# EAGLE design Temp_NeoPixel_Ring (EAGLE 6.5.0)
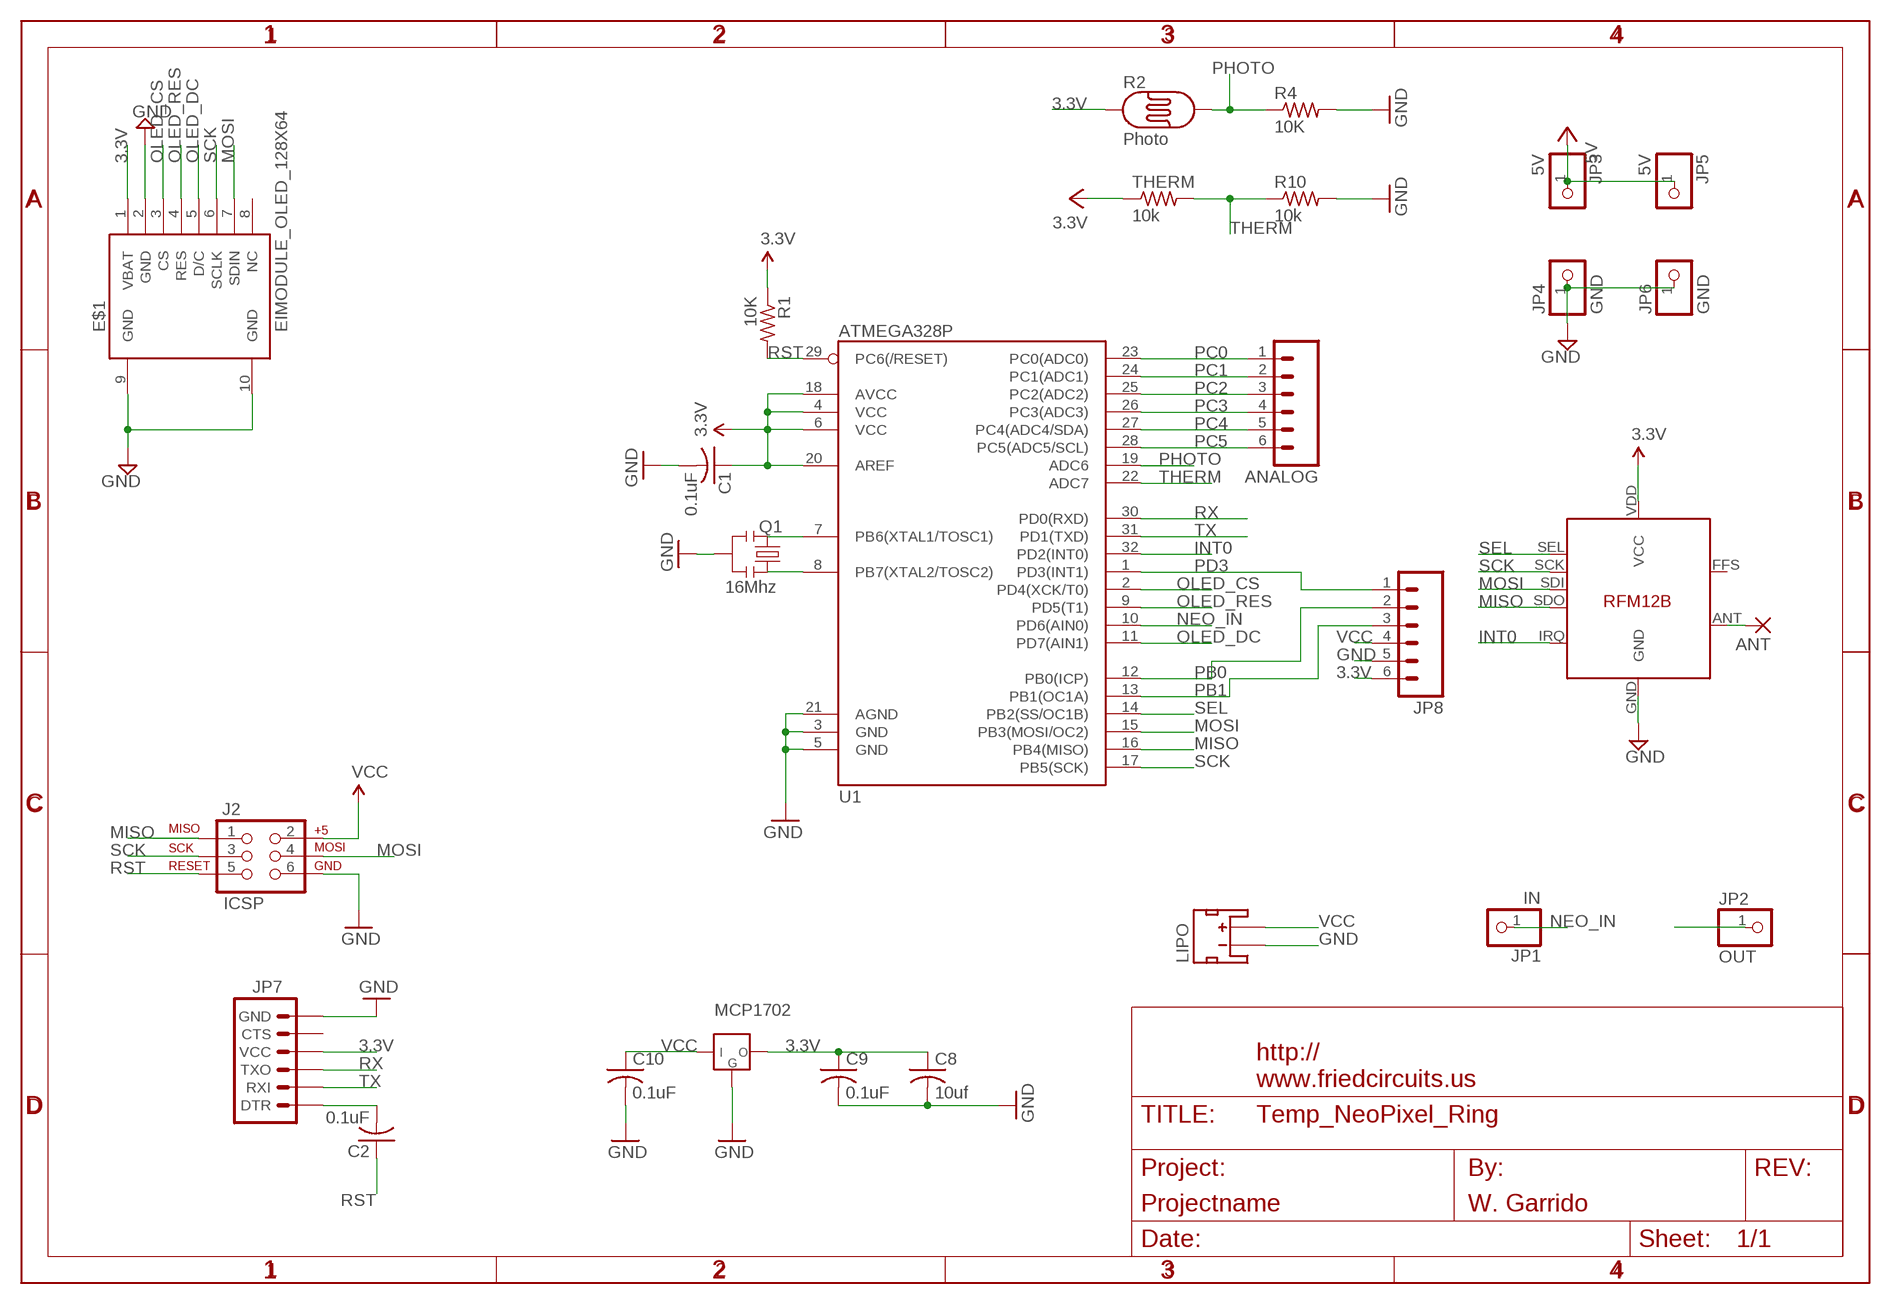
[diagram p0: schematic, sheet 1]

## Parts
ANALOG  M06LOCK  [1X06_LOCK]
ANT  1,6/0,8  [1,6/0,8]
C1  0.1uF  C-USC0805K  [C0805K]
C2  0.1uF  C-USC0805K  [C0805K]
C8  10uf  C-USC0805K  [C0805K]
C9  0.1uF  C-USC0805K  [C0805K]
C10  0.1uF  C-USC0805K  [C0805K]
E$1  EIMODULE_OLED_128X64  [EIMODULE_OLED_128X64]
J2  ICSP  AVR_SPI_PRG_62X3_LOCK  [2X3_LOCK]
JP1  IN  PINHD-1X1CB  [1X01-CLEANBIG]
JP2  OUT  PINHD-1X1CB  [1X01-CLEANBIG]
JP3  5V  PINHD-1X1CB  [1X01-CLEANBIG]
JP4  GND  PINHD-1X1CB  [1X01-CLEANBIG]
JP5  5V  PINHD-1X1CB  [1X01-CLEANBIG]
JP6  GND  PINHD-1X1CB  [1X01-CLEANBIG]
JP7  ARDUINO_SERIAL_PROGRAMLOCK  [1X06_LOCK]
JP8  M06LOCK  [1X06_LOCK]
LIPO  LIPO-3.7-6V  JST_2MM_MALE  [JST-2-SMD]
MCP1702  MCP1702SOT89  [SOT89-3]
Q1  16Mhz  RESONATORSMD  [RESONATOR-SMD]
R1  10K  R-US_R0805  [R0805]
R2  Photo  PHOTOCELLPTH  [PHOTOCELL]
R4  10K  R-US_R0805  [R0805]
R10  10k  R-US_R0805  [R0805]
THERM  10k  R-US_R0805  [R0805]
U1  ATMEGA328P  ATMEGA328_SMT  [TQFP32-08]
U$1  FRAME_DINA4_L  [FC_CREDIT]
U$2  RFM12B  [RFM12B]

## Nets
3.3V [power]: C1.1 C8.1 C9.1 E$1.1(VBAT) J2.2 JP7.4(VCC) JP8.6 MCP1702.3(E) R1.1 R2.1 THERM.1 U1.4(VCC) U1.6(VCC) U1.18(AVCC) U1.20(AREF) U$2.VDD(VCC) ; supply symbol labelled VCC
GND: C1.2 C8.2 C9.2 C10.2 E$1.2(GND) E$1.9(GND) E$1.10(GND) J2.6 JP4.1 JP6.1 JP7.6(GND) JP8.5 LIPO.1(-) MCP1702.1(B) Q1.2 R4.2 R10.2 U1.3(GND) U1.5(GND) U1.21(AGND) U$2.GND
INT0: U1.32(PD2(INT0)) U$2.IRQ
MISO: J2.1 U1.16(PB4(MISO)) U$2.SDO
MOSI: E$1.7(SDIN) J2.4 U1.15(PB3(MOSI/OC2)) U$2.SDI
N$2: C2.2 JP7.1(DTR)
N$9: Q1.1 U1.8(PB7(XTAL2/TOSC2))
N$11: Q1.3 U1.7(PB6(XTAL1/TOSC1))
N$12: ANT.1(P) U$2.ANT
NEO_IN: JP1.1 U1.10(PD6(AIN0))
OLED_CS: E$1.3(CS) U1.2(PD4(XCK/T0))
OLED_DC: E$1.5(D/C) U1.11(PD7(AIN1))
OLED_RES: E$1.4(RES) U1.9(PD5(T1))
OUT: JP2.1
PB0: JP8.2 U1.12(PB0(ICP))
PB1: JP8.3 U1.13(PB1(OC1A))
PC0: ANALOG.1 U1.23(PC0(ADC0))
PC1: ANALOG.2 U1.24(PC1(ADC1))
PC2: ANALOG.3 U1.25(PC2(ADC2))
PC3: ANALOG.4 U1.26(PC3(ADC3))
PC4: ANALOG.5 U1.27(PC4(ADC4/SDA))
PC5: ANALOG.6 U1.28(PC5(ADC5/SCL))
PD3: JP8.1 U1.1(PD3(INT1))
PHOTO: R2.2 R4.1 U1.19(ADC6)
RST: C2.1 J2.5 R1.2 U1.29(PC6(/RESET))
RX: JP7.3(TXO) U1.30(PD0(RXD))
SCK: E$1.6(SCLK) J2.3 U1.17(PB5(SCK)) U$2.SCK
SEL: U1.14(PB2(SS/OC1B)) U$2.SEL
THERM: R10.1 THERM.2 U1.22(ADC7)
TX: JP7.2(RXI) U1.31(PD1(TXD))
VCC [power]: C10.1 JP3.1 JP5.1 JP8.4 LIPO.2(+) MCP1702.2(C) ; supply symbol labelled 5V
Unconnected: E$1.8(NC) JP7.5(CTS) LIPO.NC1(PAD1) LIPO.NC2(PAD2) U$2.FFS

## Library data of the parts
ANALOG JP8 = SparkFun-Connectors:M06: Header 6 Standard 6-pin 0.1" header. Use with straight break away headers (SKU : PRT-00116), right angle break away headers (PRT-00553), swiss pins (PRT-00743), machine pins (PRT-00117), and female headers (PRT-00115). Molex polarized connector foot print use with SKU : PRT-08094 with associated crimp pins and housings. NOTES ON THE VARIANTS LOCK and LOCK_LONGPADS... This footprint was designed to help hold the alignment of a through-hole component (i.e. 6-pin header) while soldering it into place. You may notice that each hole has been shifted either up or down by 0.005 of an inch from it's more standard position (which is a perfectly straight line). This slight alteration caused the pins (the squares in the middle) to touch the edges of the holes. Because they are alternating, it causes a "brace" to hold the component in place. 0.005 has proven to be the perfect amount of "off-center" position when using our standard breakaway headers. Although looks a little odd when you look at the bare footprint, once you have a header in there, the alteration is very hard to notice. Also,if you push a header all the way into place, it is covered up entirely on the bottom side. This idea of altering the position of holes to aid alignment will be further integrated into the Sparkfun Library for other footprints. It can help hold any component with 3 or more connection pins.
ANT = JeeLabs:1,6/0,8: THROUGH-HOLE PAD
C1 C2 C8-C10 = adafruit:C-US: CAPACITOR, American symbol
E$1 = FriedCircuits:EIMODULE_OLED_128X64
J2 = SparkFun-Connectors:AVR_SPI_PRG_6: AVR ISP 6 Pin This is the reduced ISP connector for AVR programming. Common on Arduino. This footprint will take up less PCB space and can be used with a 10-pin to 6-pin adapter such as SKU: BOB-08508
JP1-JP6 = adafruit:PINHD-1X1: Pin header 1x1 for 0.1" spacing With round pins
JP7 = SparkFun-Connectors:ARDUINO_SERIAL_PROGRAM: FTDI connector footprints
LIPO = SparkFun-Connectors:JST_2MM_MALE: Mates to single-cell LiPo batteries. CONN-08352; PROD_ID: CONN-08352
MCP1702 = FriedCircuits:MCP1702: MCP1702 LDO Regulator in SOT-89, SOT-23A-2 and TO-92
Q1 = SparkFun:RESONATOR: Resonator Small SMD resonator. This is the itty bitty 10/20MHz resonators with built in caps. CSTCE10M0G55 and CSTCE20M0V53. Footprint has been reviewed closely but hasn't been tested yet.
R1 R4 R10 THERM = adafruit:R-US_: RESISTOR, American symbol
R2 = SparkFun:PHOTOCELL: Photocell Also known as a CdS photoresistor. This is a low cost way to detect light levels. Resistance decreases with more incoming light. SparkFun SKU: SEN-09088
U1 = SparkFun-DigitalIC:ATMEGA328_SMT: 32-Pin Atmega328 part Commonly used on Arduino compatible boards Available in QFP and QFN packages TQFP is IC-09069 QFN is non-stock; PROD_ID: IC-09069
U$1 = FriedCircuits:FRAME_DINA4_L: A4 FC frame Standard FriedCircuits schematic frame. Automagically adds the standard texts to the PCB Use the atrribute in the schematic editor to change the fields.; AUTHOR: W. Garrido; FF1: fulfillment by; FF2: FriedCircuits; FF3: www.friedcircuits.us; PROJECT: Projectname; URL1: http://; URL2: www.friedcircuits.us
U$2 = lh-library:RFM12B

## Net classes
0 default: width 0.203 mm, drill 0.203 mm
1 power: width 0.254 mm, drill 0.203 mm
3 3.3V: width 0.254 mm, drill 0.203 mm

## Board
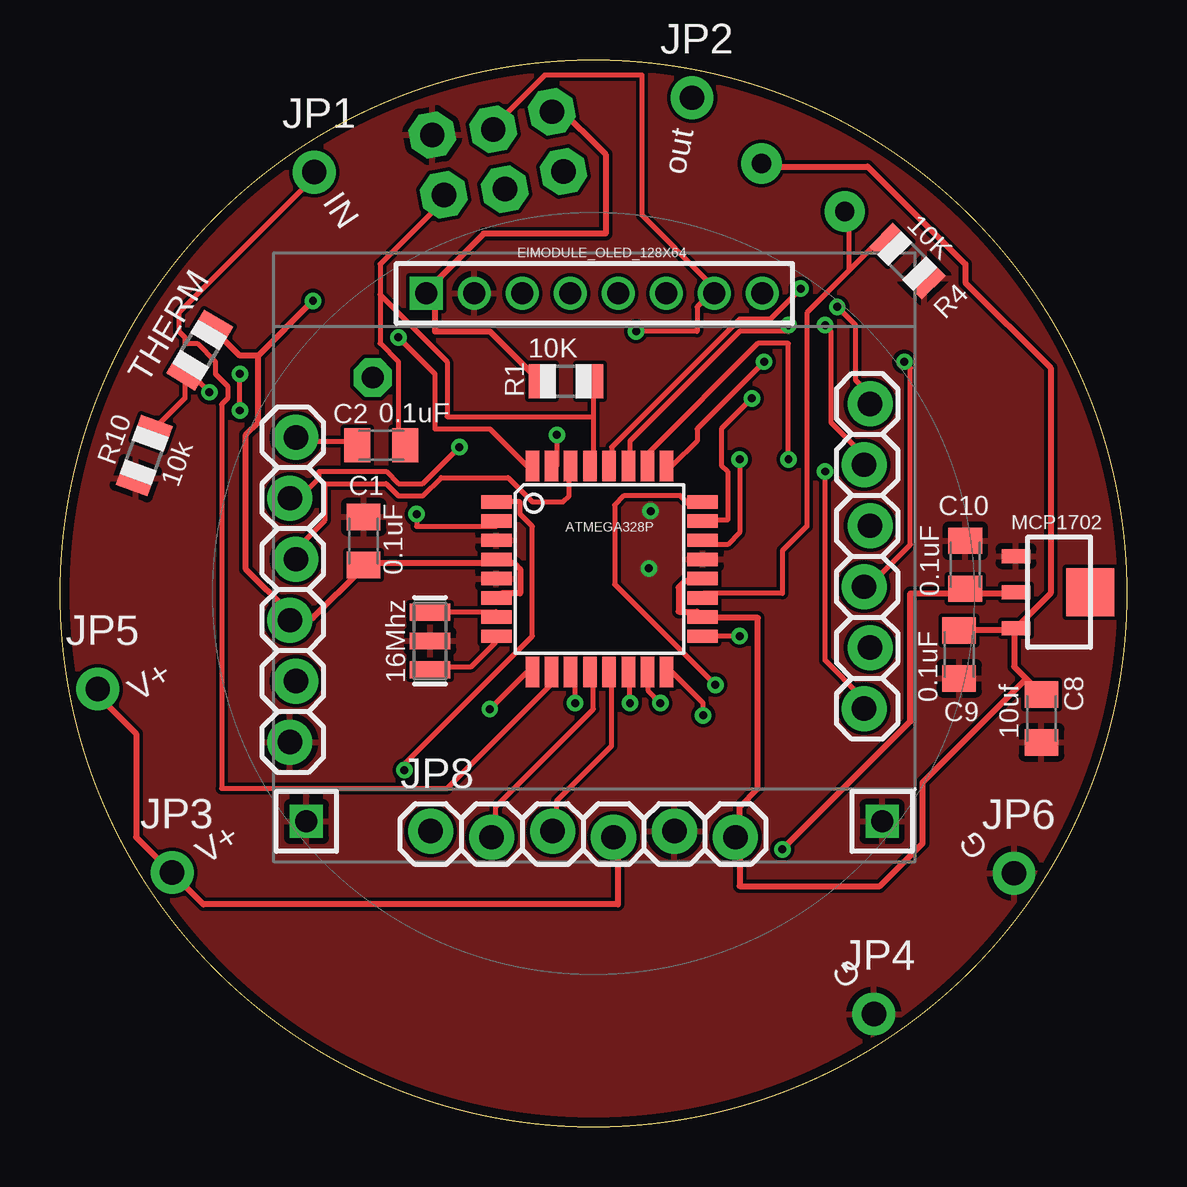
[diagram p1: board, top side]
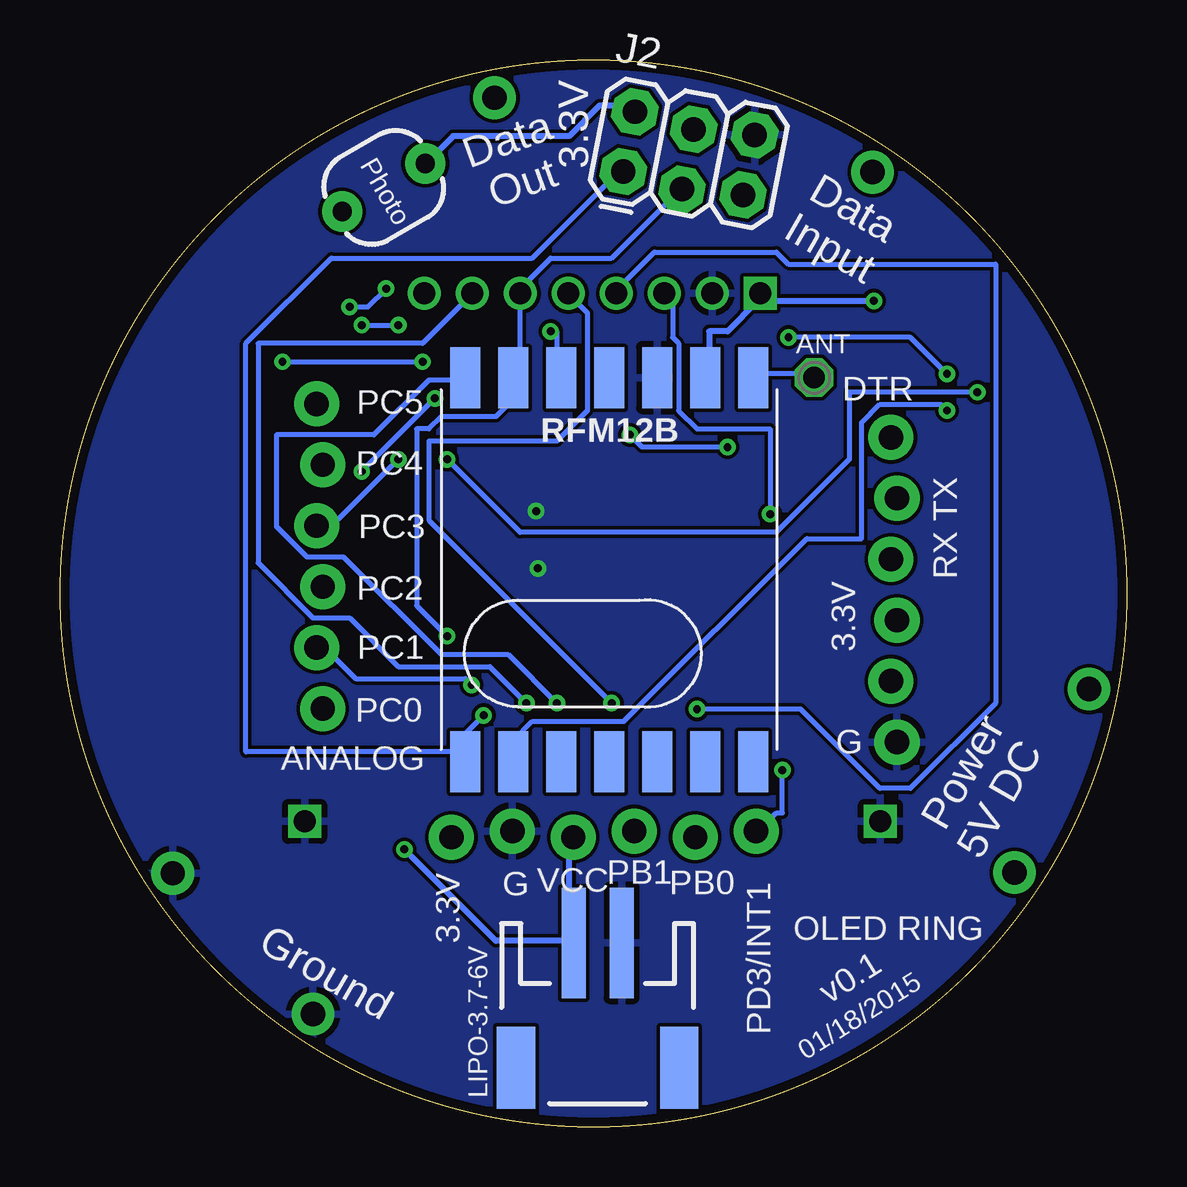
[diagram p2: board, bottom side, seen from below]

Size 44.45 x 44.45 mm. Coordinates in mm from the lower left corner, seen from the top.
Outline: circle at 22.23,22.23 radius 22.23
Copper layers (1*16): Top 0.0356mm / dielectric 1.5011mm / Bottom 0.0356mm
Design rules "LaenPCBOrder-Tinited": minimum track width 6mil, minimum drill 13mil, track to track 6mil, track to pad 6mil, pad to pad 6mil, via to via 6mil, smd to smd 6mil, copper to edge 15mil, drill to drill 6mil, minimum pad ring 7mil, minimum via ring 7mil, stop-mask expansion 2mil, vias tented up to drill 100mil, thermal gap 10mil

### Footprints (pad centres in the part's own frame; a part is rotated, then mirrored left to right if it is on the bottom)
1X06_LOCK = drill 1.016 pad 1.88: 1 0,0; 2 2.54,-0.254; 3 5.08,0; 4 7.62,-0.254; 5 10.16,0; 6 12.7,-0.254
1,6/0,8 = drill 0.9 pad 1.6 octagon: 1 0,0
C0805K = smd 1.1 x 1.4: 1 -1,0; 2 1,0
EIMODULE_OLED_128X64 = drill 0.914 square: 1 6.35,23.7; 9 1.35,1.7; 10 25.34,1.7 | drill 0.914: 2 8.35,23.7; 3 10.35,23.7; 4 12.35,23.7; 5 14.35,23.7; 6 16.35,23.7; 7 18.35,23.7; 8 20.35,23.7
2X3_LOCK = drill 1.016 pad 1.88 octagon: 1 0,0; 2 0,2.54; 3 2.54,-0.254; 4 2.54,2.286; 5 5.08,0; 6 5.08,2.54
1X01-CLEANBIG = drill 1.016 pad 1.778: 1 0,0
JST-2-SMD = smd 1 x 4.6: 1 -1,-3.7; 2 1,-3.7 | smd 1.6 x 3.4: NC1 -3.4,1.5; NC2 3.4,1.5
SOT89-3 = smd 0.58 x 1.2: 1 -1.5,-1.8; 2 0,-1.8; 3 1.5,-1.8 | smd 2 x 2: 4 0,1.3
RESONATOR-SMD = smd 0.7 x 1.7: 1 -1.2,0; 2 0,0; 3 1.2,0
R0805 = smd 1.1 x 1.4: 1 -1,0; 2 1,0
PHOTOCELL = drill 0.8 pad 1.676: 1 -2,0; 2 2,0
TQFP32-08 = smd 1.27 x 0.559: 1 -4.293,2.8; 2 -4.293,2; 3 -4.293,1.2; 4 -4.293,0.4; 5 -4.293,-0.4; 6 -4.293,-1.2; 7 -4.293,-2; 8 -4.293,-2.8; 17 4.293,-2.8; 18 4.293,-2; 19 4.293,-1.2; 20 4.293,-0.4; 21 4.293,0.4; 22 4.293,1.2; 23 4.293,2; 24 4.293,2.8 | smd 0.559 x 1.27: 9 -2.8,-4.293; 10 -2,-4.293; 11 -1.2,-4.293; 12 -0.4,-4.293; 13 0.4,-4.293; 14 1.2,-4.293; 15 2,-4.293; 16 2.8,-4.293; 25 2.8,4.293; 26 2,4.293; 27 1.2,4.293; 28 0.4,4.293; 29 -0.4,4.293; 30 -1.2,4.293; 31 -2,4.293; 32 -2.8,4.293
RFM12B = smd 2.54 x 1.27: ANT 8,-6; FFS -8,2; GND 8,-2; IRQ -8,4; P$8 -8,0; P$9 -8,-2; P$10 -8,-4; P$12 -8,-6; P$16 8,0; SCK 8,4; SDI 8,2; SDO -8,6; SEL 8,6; VDD 8,-4

### Placement (x,y rotation side)
ANALOG  33.5,17.42 90 top
ANT  13.03,31.22 0 bottom
C1  12.65,24.41 90 top
C2  13.39,28.4 180 top
C8  40.89,17.02 270 top
C9  37.47,19.69 270 top
C10  37.72,23.42 90 top
E$1  8.92,11.02 0 top
J2  20.98,39.8 349 bottom
JP1  10.59,39.78 0 top
JP2  26.34,42.88 0 top
JP3  4.67,10.59 0 top
JP4  33.91,4.7 0 top
JP5  1.57,18.24 0 top
JP6  39.75,10.57 0 top
JP7  9.83,28.73 270 top
JP8  15.44,12.32 0 top
LIPO  22.05,3.96 180 bottom
MCP1702  41.63,22.28 270 top
Q1  15.42,20.24 90 top
R1  21.08,31.06 0 top
R2  30.96,39.14 210 bottom
R4  35.31,36.07 315 top
R10  3.51,27.97 250 top
THERM  5.82,32.36 239 top
U1  22.48,23.24 0 top
U$1  -11.15,4.8 0 top  (outside the outline)
U$2  21.56,23.22 90 bottom

### Tracks (layer width: path | path; a pad name or v marks a point on that pad's centre or on a via)
3.3V  (via drill 0.33)
  Top 0.254: 39.75,20.7 37.47,20.7 C9.1 | 40.26,18.67 39.75,19.18 39.75,20.7 | 40.26,18.67 40.77,18.16 C8.1 | 39.75,20.7 MCP1702.3 40.01,20.96 41.28,22.23 41.28,31.62 37.72,35.18 37.72,35.94 33.66,40.01 29.34,40.01 R2.1 | U1.20 26.54,22.73 26.04,22.73 25.78,22.48 25.78,21.46 26.54,21.46 U1.18 26.8,21.21 29.08,21.21 29.08,14.1 28.32,13.34 28.32,12.07 | 40.26,18.67 35.94,14.35 35.94,11.81 34.16,10.03 28.32,10.03 28.32,12.07 | 28.32,12.07 JP8.6 | U1.6 18.42,22.23 19.18,22.23 19.18,23.24 18.92,23.5 18.42,23.5 U1.4 18.16,23.5 12.83,23.5 C1.1 12.57,23.24 10.54,21.21 9.78,21.21 JP7.4 9.53,21.21 9.53,21.46 7.75,23.24 7.75,28.83 8.26,29.34 8.26,32.13 | 8.26,32.13 7.49,32.13 6.48,33.15 THERM.1 | R1.1 19.94,31.12 17.91,33.15 15.62,33.15 15.62,34.42 15.37,34.67 E$1.1 15.37,34.92 17.65,37.21 22.73,37.21 22.73,40.51 20.7,42.55 J2.2 | v10.54,34.42 8.26,32.13
  Bottom 0.254: 15.37,34.42 15.11,34.67 E$1.1 15.37,34.42 | 15.37,34.42 16.64,33.15 17.4,33.15 17.4,31.37 U$2.VDD | R2.1 29.08,40.26 28.07,41.28 23.24,41.28 21.97,42.55 20.7,42.55 J2.2 | 15.37,34.42 v10.54,34.42
GND  (via drill 0.33)
  other vias: 24.54,23.27 24.61,25.65
  pour Top: 45.09,22.23 arc90 22.23,45.09 arc90 -0.63,22.23 arc90 22.23,-0.63 arc90
  pour Bottom: 45.09,22.23 arc90 22.23,45.09 arc90 -0.63,22.23 arc90 22.23,-0.63 arc90
INT0  (via drill 0.33)
  Top 0.203: v14.1,32.89 15.62,31.37 15.62,29.08 17.91,29.08 19.43,27.56 U1.32 | v7.49,29.85 v7.49,31.37
  Bottom 0.203: v14.1,32.89 9.02,32.89 v7.49,31.37 | v7.49,29.85 7.75,30.1 10.29,30.1 11.05,29.34 11.05,24.51 13.34,24.51 20.96,16.89 24.77,16.89 25.53,16.13 25.53,15.37 U$2.IRQ
MISO  (via drill 0.33)
  Top 0.203: v26.8,17.15 26.8,17.65 25.53,18.92 U1.16
  Bottom 0.203: v26.8,17.15 27.56,16.38 27.56,15.62 | 27.56,15.62 27.56,15.37 U$2.SDO 27.56,15.62 | 27.56,15.62 36.7,15.62 36.7,32.64 33.15,36.2 24.77,36.2 21.21,39.75 J2.1
MOSI  (via drill 0.33)
  Top 0.203: v25.02,17.65 24.51,18.16 24.51,18.92 U1.15 | v24,33.15 26.54,33.15 26.54,34.16 27.05,34.67 E$1.7 27.05,34.92 27.05,35.18 24.26,37.97 24.26,43.81 20.19,43.81 18.16,41.78 J2.4
  Bottom 0.203: v25.02,17.65 26.54,19.18 30.35,19.18 32.39,21.21 33.91,21.21 36.2,23.5 36.2,32.64 29.34,32.64 27.3,34.67 E$1.7 | v24,33.15 23.75,33.15 23.75,31.37 U$2.SDI
N$2
  Top 0.203: C2.2 12.32,28.58 10.03,28.58 JP7.1
N$9
  Top 0.203: U1.8 18.16,20.19 17.15,19.18 15.62,19.18 Q1.1
N$11
  Top 0.203: U1.7 18.16,21.46 15.62,21.46 Q1.3
N$12
  Bottom 0.203: U$2.ANT 15.37,31.37 13.08,31.37 ANT.1
NEO_IN
  Top 0.203: U1.10 20.45,18.92 20.45,18.42 16.13,14.1 6.73,14.1 6.73,30.1 6.99,30.35 6.99,30.86 6.48,31.37 6.48,31.88 5.71,32.64 5.21,32.64 5.21,32.89 4.95,33.15 4.95,33.91 10.54,39.5 10.54,39.75 JP1.1
OLED_CS  (via drill 0.33)
  Top 0.203: v14.86,25.53 14.86,25.02 18.16,25.02 U1.2
  Bottom 0.203: v14.86,25.53 14.86,29.08 17.91,29.08 18.67,29.85 18.67,32.64 18.92,32.89 18.92,34.67 19.18,34.67 E$1.3
OLED_DC  (via drill 0.33)
  Top 0.203: v21.46,17.65 21.46,18.92 U1.11
  Bottom 0.203: v21.46,17.65 29.08,25.27 29.08,28.58 23.75,28.58 22.48,29.85 22.48,33.91 23.24,34.67 E$1.5
OLED_RES  (via drill 0.33)
  Top 0.203: v17.91,17.4 19.43,18.92 U1.9
  Bottom 0.203: v17.91,17.4 13.59,17.4 10.29,14.1 9.02,14.1 5.46,17.65 5.46,35.94 14.1,35.94 14.61,36.45 19.69,36.45 21.21,34.92 E$1.4
PB0
  Top 0.203: U1.12 22.23,18.92 22.23,17.4 18.16,13.34 18.16,12.07 JP8.2
PB1
  Top 0.203: U1.13 22.99,18.92 22.99,15.88 20.7,13.59 20.7,12.32 JP8.3
PC0  (via drill 0.33)
  Top 0.203: v28.83,30.35 27.56,29.08 27.56,27.56 27.81,27.3 27.81,25.27 26.8,25.27 U1.23 | v31.88,27.3 31.88,19.43 33.4,17.91 33.4,17.65 ANALOG.1
  Bottom 0.203: v31.88,27.3 v28.83,30.35
PC1  (via drill 0.33)
  Top 0.203: 26.54,26.04 U1.24 26.69,25.96 26.19,25.96 25.83,26.31 23.52,26.31 23.11,25.91 23.11,22.61 v27.3,18.42
  Bottom 0.203: v27.3,18.42 27.56,18.67 32.13,18.67 33.4,19.94 33.66,19.94 ANALOG.2
PC2  (via drill 0.33)
  Top 0.203: v29.34,31.88 26.54,29.08 26.54,28.58 25.53,27.56 U1.25 | v35.18,31.88 35.43,31.62 35.43,24.26 33.66,22.48 ANALOG.3
  Bottom 0.203: v35.18,31.88 v29.34,31.88
PC3  (via drill 0.33)
  Top 0.203: v30.35,27.81 30.35,32.64 29.08,32.64 24.51,28.07 24.51,27.56 U1.26
  Bottom 0.203: v30.35,27.81 32.89,25.27 33.66,25.27 ANALOG.4
PC4  (via drill 0.33)
  Top 0.203: v30.35,33.4 30.35,33.15 28.32,33.15 23.75,28.58 23.75,27.56 U1.27 | v31.88,33.4 32.13,33.15 32.13,29.34 33.4,28.07 33.4,27.81 ANALOG.5
  Bottom 0.203: v31.88,33.4 v30.35,33.4
PC5  (via drill 0.33)
  Top 0.203: v30.86,34.92 29.59,33.66 28.32,33.66 22.99,28.32 22.99,27.56 U1.28 | v32.39,34.16 33.15,33.4 33.15,31.12 33.66,30.61 33.66,30.35 ANALOG.6
  Bottom 0.203: v30.86,34.92 31.62,34.16 v32.39,34.16
PD3  (via drill 0.33)
  Top 0.203: v14.35,14.86 14.35,15.11 19.69,20.45 19.69,25.02 19.18,25.53 19.18,26.04 18.42,26.04 U1.1
  Bottom 0.203: v14.35,14.86 14.35,13.08 14.61,13.08 15.37,12.32 JP8.1
PHOTO
  Top 0.203: 32.89,35.69 33.91,36.7 34.42,36.7 R4.1 | 32.89,35.69 31.12,33.91 31.12,25.02 30.1,24 30.1,22.23 26.8,22.23 U1.19 | 32.89,35.69 32.89,37.97 R2.2
RST
  Top 0.203: 22.23,29.59 22.23,30.86 R1.2 | 22.23,29.59 22.23,27.56 U1.29 | 13.34,34.67 13.34,35.94 15.88,38.48 15.88,38.73 J2.5 | 13.34,34.67 13.34,32.64 14.1,31.88 14.1,28.83 14.35,28.58 C2.1 | 22.23,29.59 16.13,29.59 16.13,31.88 13.34,34.67
RX
  Top 0.203: U1.30 21.21,27.3 21.21,26.29 20.96,26.04 19.69,26.04 18.67,27.05 15.88,27.05 15.11,26.29 14.1,26.29 13.59,26.8 11.05,26.8 11.05,25.27 10.03,24.26 10.03,23.75 JP7.3
SCK  (via drill 0.33)
  Top 0.203: v28.32,20.45 26.8,20.45 U1.17
  Bottom 0.203: v28.32,20.45 29.59,21.72 29.59,29.08 29.08,29.08 28.58,29.59 26.29,29.59 25.78,30.1 25.78,31.12 U$2.SCK 25.53,31.37 25.27,31.37 25.27,34.67 E$1.6 25.27,34.92 24,36.2 21.46,36.2 18.67,38.99 J2.3
SEL  (via drill 0.33)
  Top 0.203: v23.75,17.65 23.75,18.92 U1.14
  Bottom 0.203: v23.75,17.65 25.78,19.69 28.58,19.69 32.64,23.75 34.16,23.75 35.43,25.02 35.43,28.83 31.37,28.83 29.08,31.12 27.81,31.12 U$2.SEL
THERM  (via drill 0.33)
  Top 0.203: v28.32,27.81 28.32,24.77 27.81,24.26 26.8,24.26 U1.22 | v6.22,30.61 5.46,31.37 THERM.2 5.21,31.37 5.21,30.35 3.94,29.08 R10.1
  Bottom 0.203: v28.32,27.81 25.27,24.77 14.61,24.77 11.56,27.81 11.56,30.61 v6.22,30.61
TX  (via drill 0.33)
  Top 0.203: v20.7,28.83 20.7,27.56 U1.31 | v16.64,28.32 15.11,26.8 14.1,26.8 13.59,27.3 10.8,27.3 10.8,27.05 9.78,26.04 JP7.2
  Bottom 0.203: v20.7,28.83 20.19,28.32 v16.64,28.32
VCC  (via drill 0.33)
  Top 0.254: JP5.1 1.65,18.16 1.65,17.91 3.18,16.38 3.18,12.07 4.45,10.8 JP3.1 4.7,10.54 5.97,9.27 23.24,9.27 23.24,12.07 JP8.4 | 37.72,22.23 39.75,22.23 MCP1702.2 | 37.72,22.23 35.43,22.23 35.43,16.89 v30.1,11.56 | 37.72,22.23 C10.1
  Bottom 0.254: v30.1,11.56 26.29,7.75 23.24,7.75 | 23.24,7.75 23.24,12.07 JP8.4 | 23.24,7.75 LIPO.2

### Text on the board
tPlace: out | IN | V+ | V+ | G | G
bPlace: 3.3V | Data / Out | Data / Input | DTR | PC5 | TX | PC4 | RX | PC3 | 3.3V | PC2 | PC1 | PC0 | G | Power | 5V DC | PB1 | VCC | PB0 | G | OLED RING | 3.3V | Ground | v0.1 | PD3/INT1 | 01/18/2015